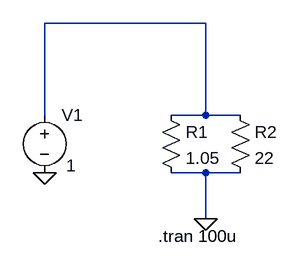
[diagram p0: schematic power-resistor-trim.asc]
power-resistor-trim.asc, the LTspice schematic file:
Version 4
SHEET 1 880 680
WIRE 32 0 -192 0
WIRE -192 128 -192 0
WIRE 32 128 32 0
WIRE 32 128 -16 128
WIRE 80 128 32 128
WIRE 32 208 -16 208
WIRE 80 208 32 208
WIRE 32 272 32 208
FLAG 32 272 0
FLAG -192 208 0
SYMBOL res -32 112 R0
SYMATTR InstName R1
SYMATTR Value 1.05
SYMBOL res 64 112 R0
SYMATTR InstName R2
SYMATTR Value 22
SYMBOL voltage -192 112 R0
WINDOW 123 24 44 Left 2
WINDOW 39 0 0 Left 0
WINDOW 3 30 86 Left 2
SYMATTR Value 1
SYMATTR InstName V1
TEXT -34 296 Left 2 !.tran 100u

The netlist it stands for:
* power-resistor-trim.asc
R1 N001 0 1.05
R2 N001 0 22
V1 N001 0 1
.tran 100u
.backanno
.end